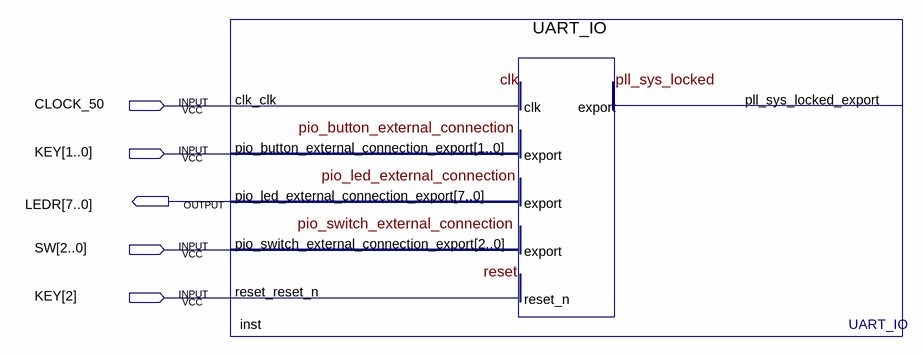
[diagram p0: schematic sheet]
// Quartus schematic Uart_Demo_Top.bdf as structural Verilog: 1 symbols, 5 pins
module Uart_Demo_Top (
  input  CLOCK_50,
  input  [2:0] KEY,
  input  [2:0] SW,
  output [7:0] LEDR
);

  UART_IO inst (
    .clk_clk(CLOCK_50), .pio_button_external_connection_export(KEY[1:0]),
    .pio_switch_external_connection_export(SW), .reset_reset_n(KEY[2]),
    .pio_led_external_connection_export(LEDR));  // open: pll_sys_locked_export
endmodule
